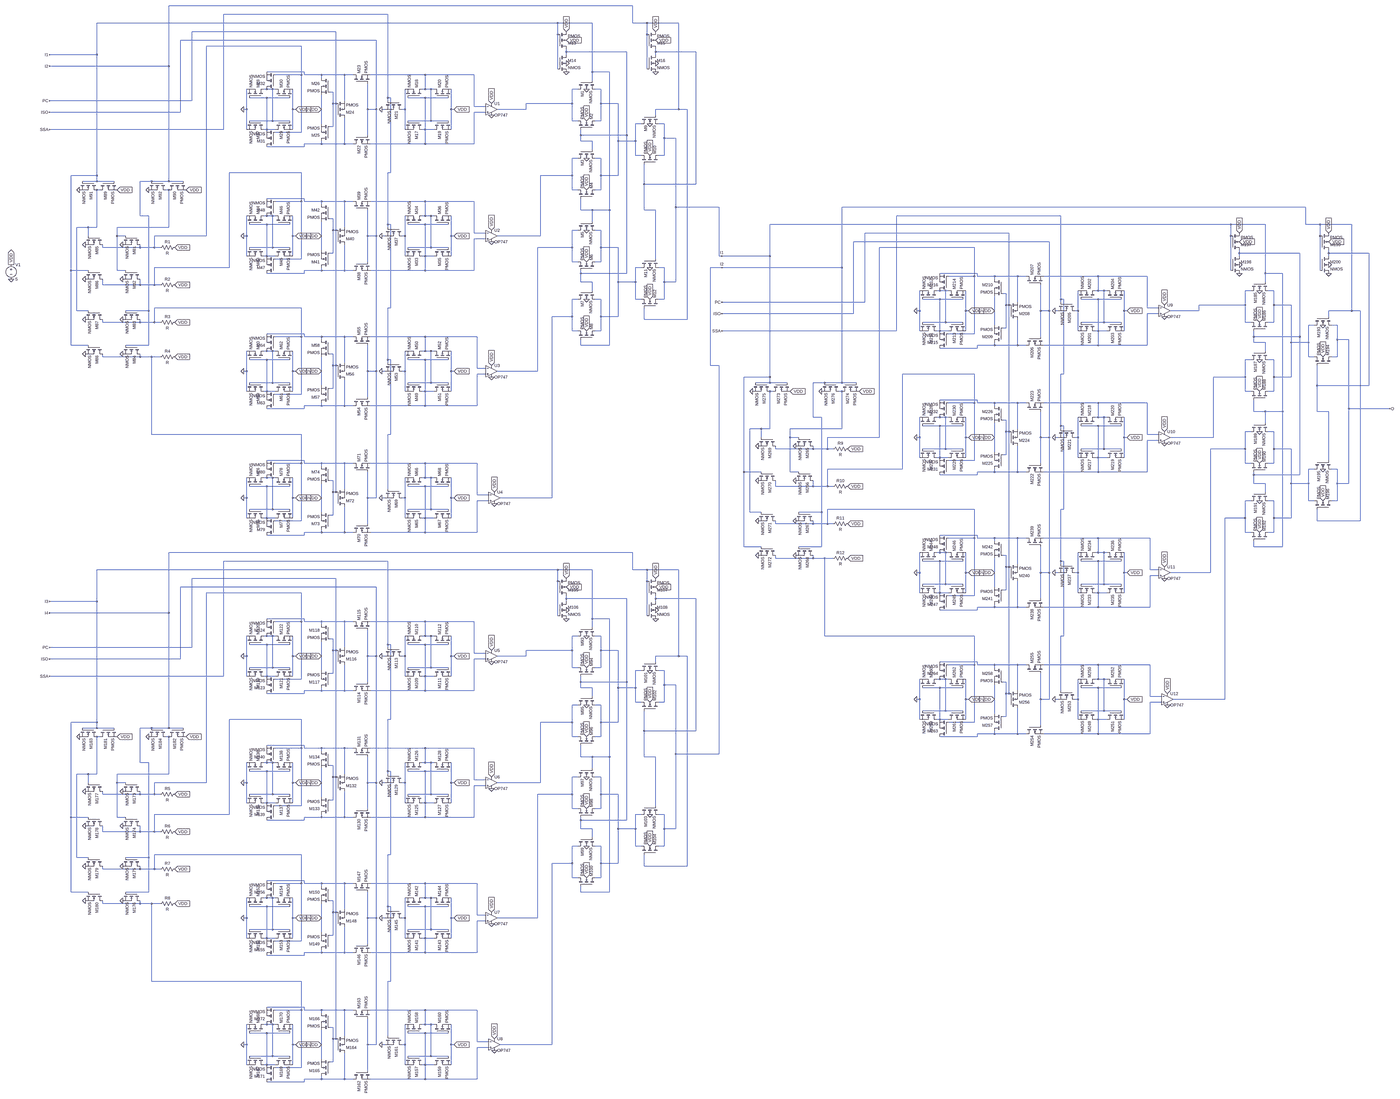
[diagram p0: schematic lut4using2.asc, whole sheet]
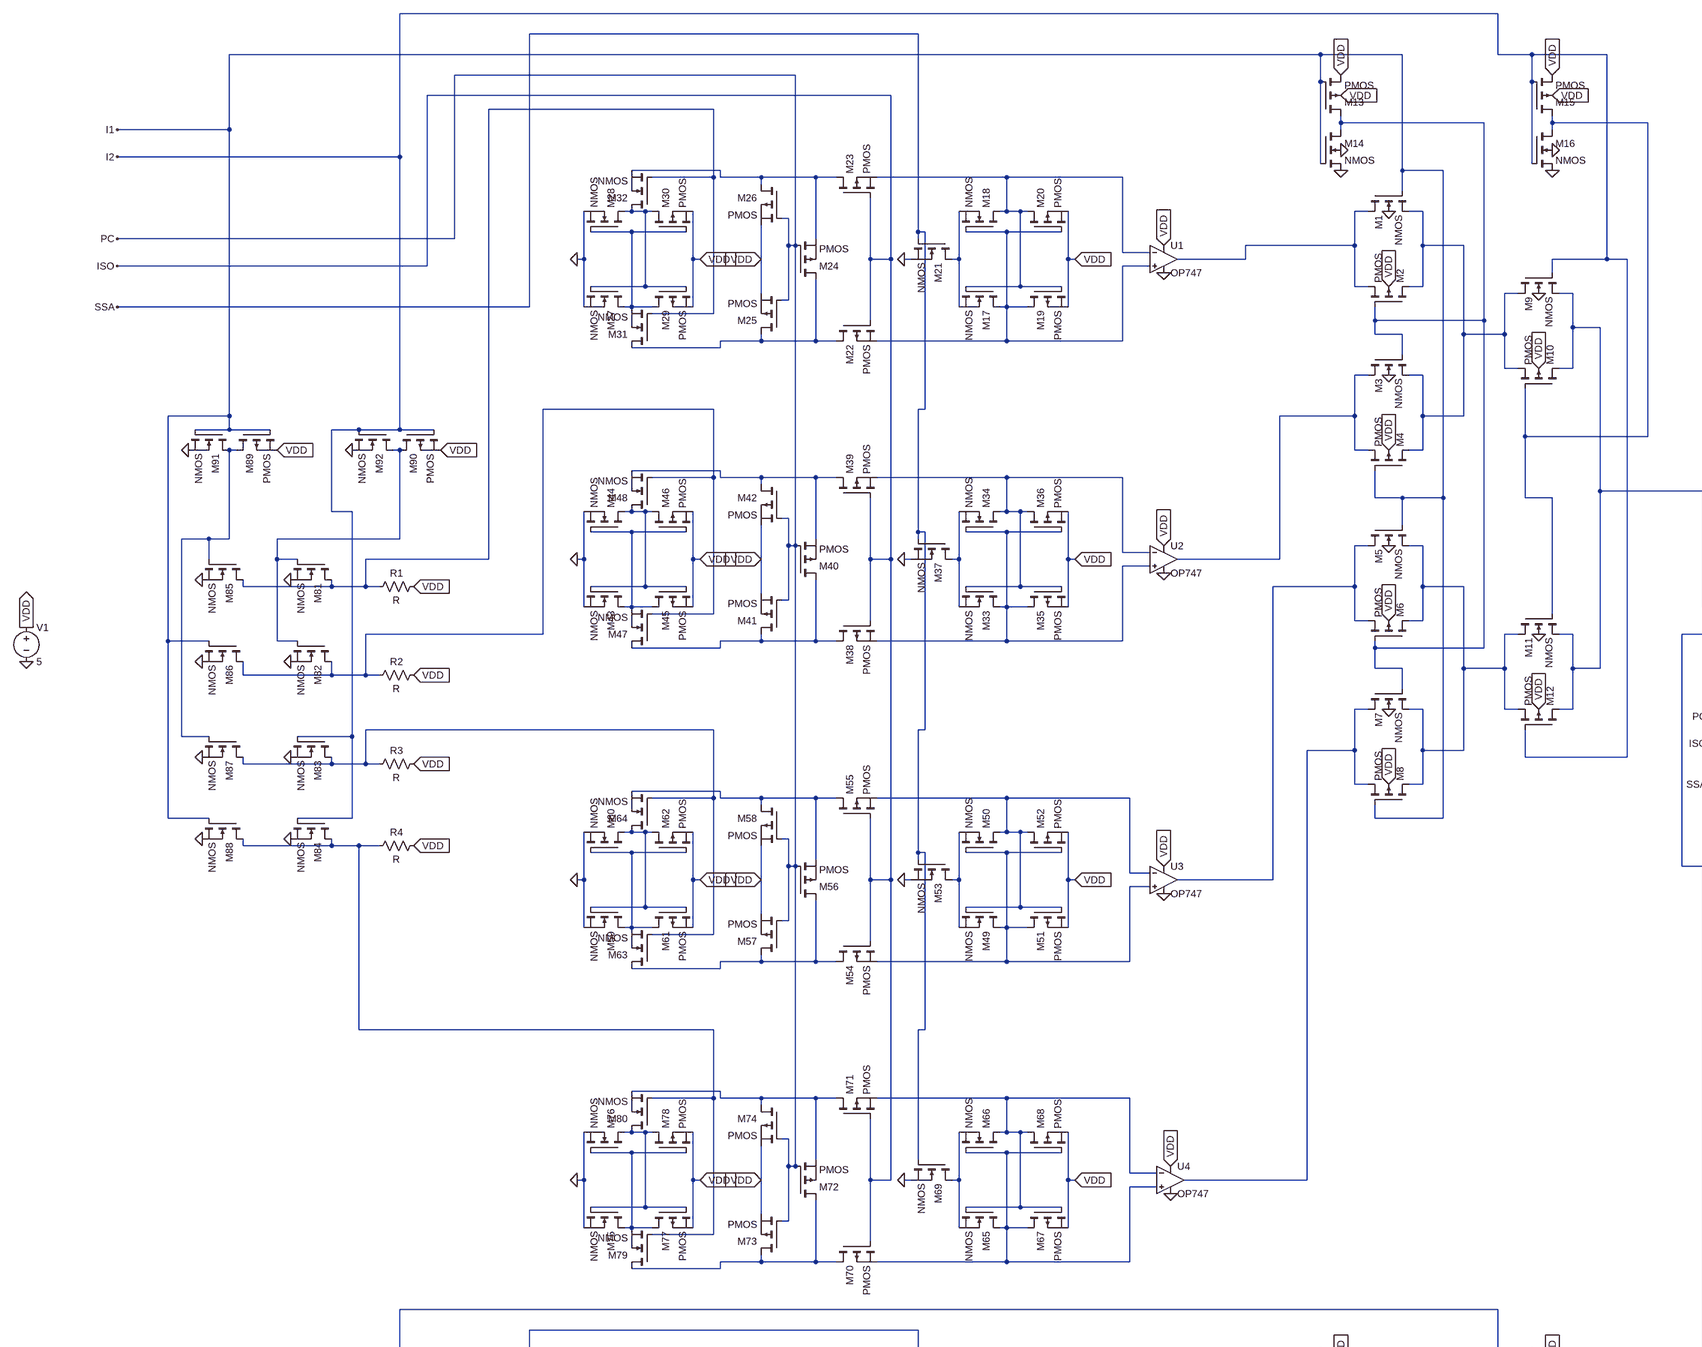
[diagram p1: schematic lut4using2.asc, part, row 1 of 2, column 1 of 2]
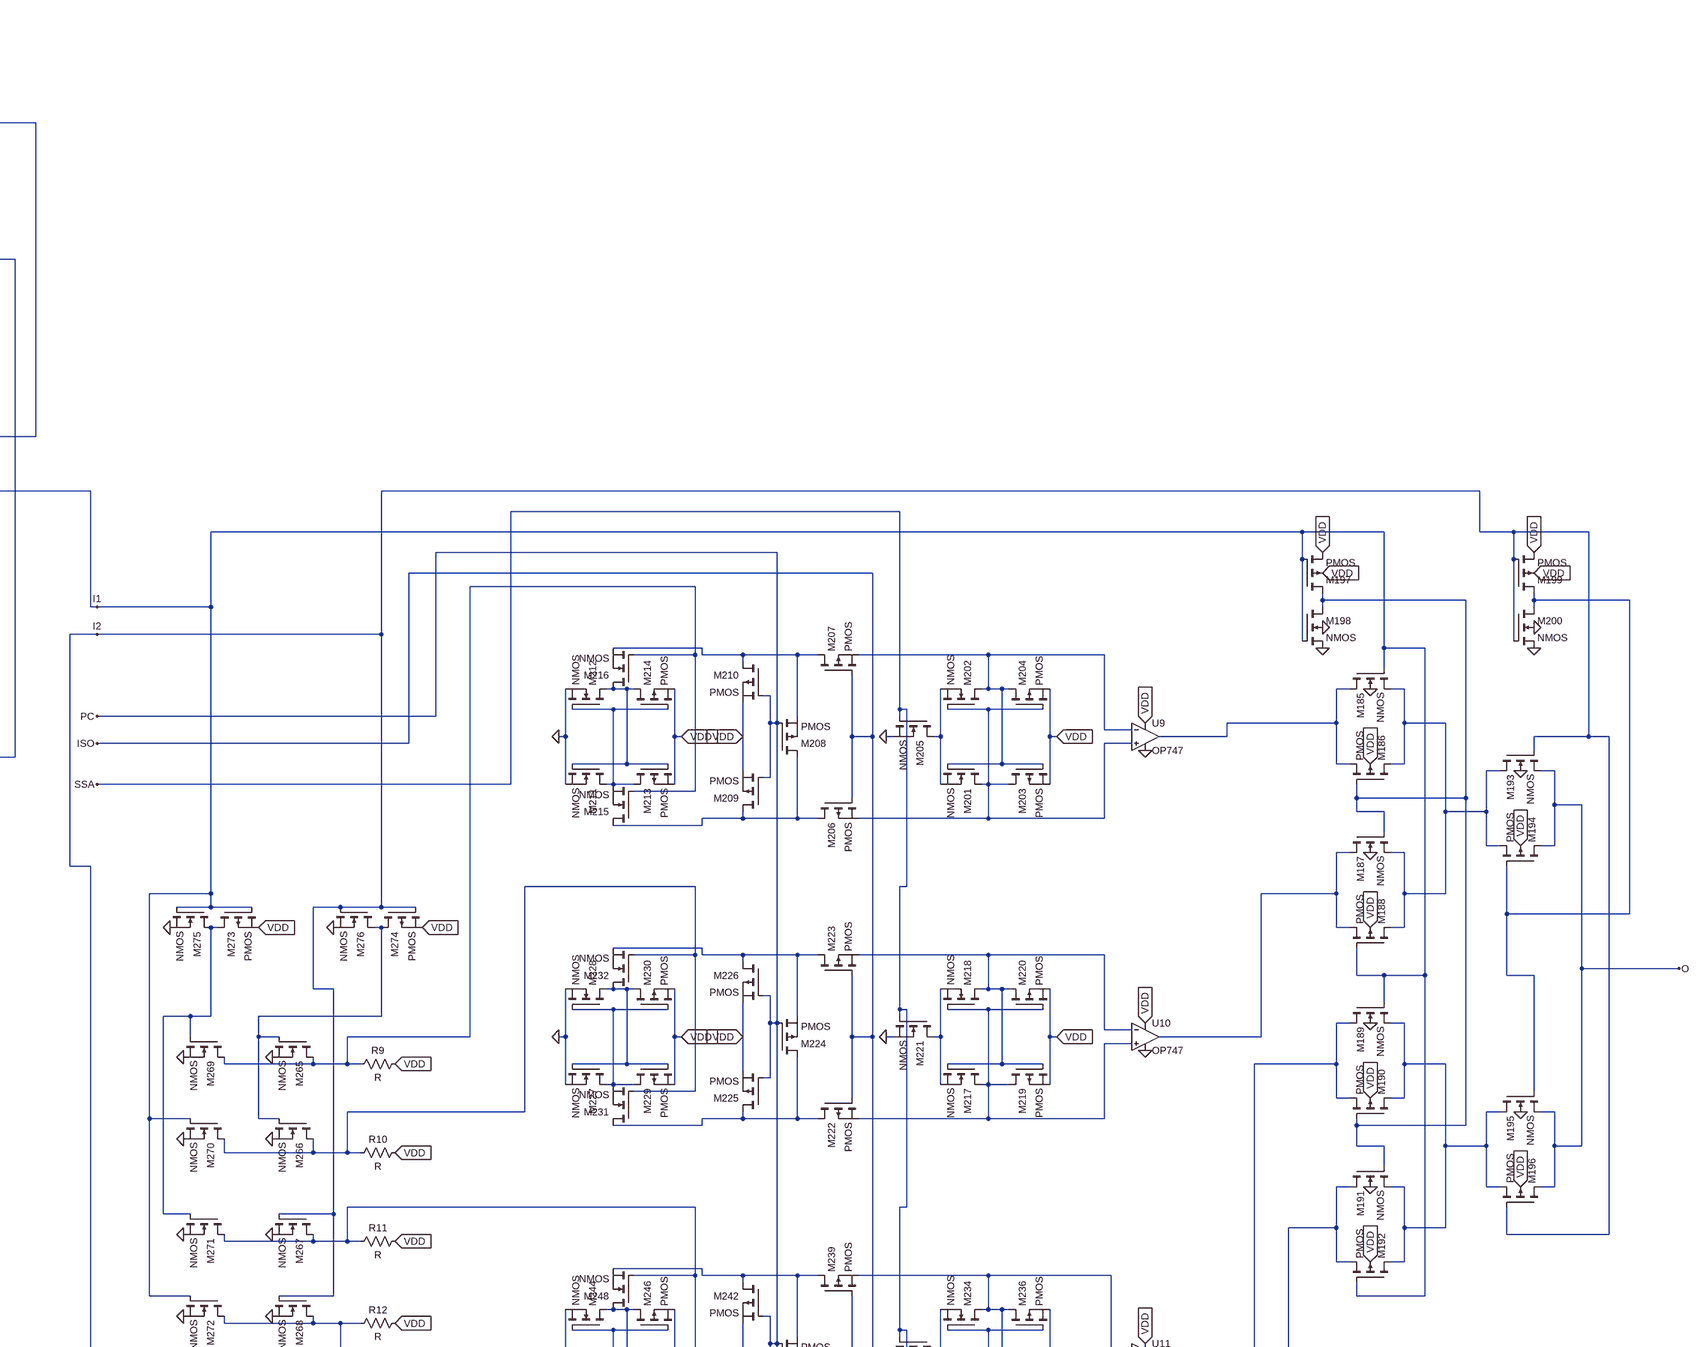
[diagram p2: schematic lut4using2.asc, part, row 1 of 2, column 2 of 2]
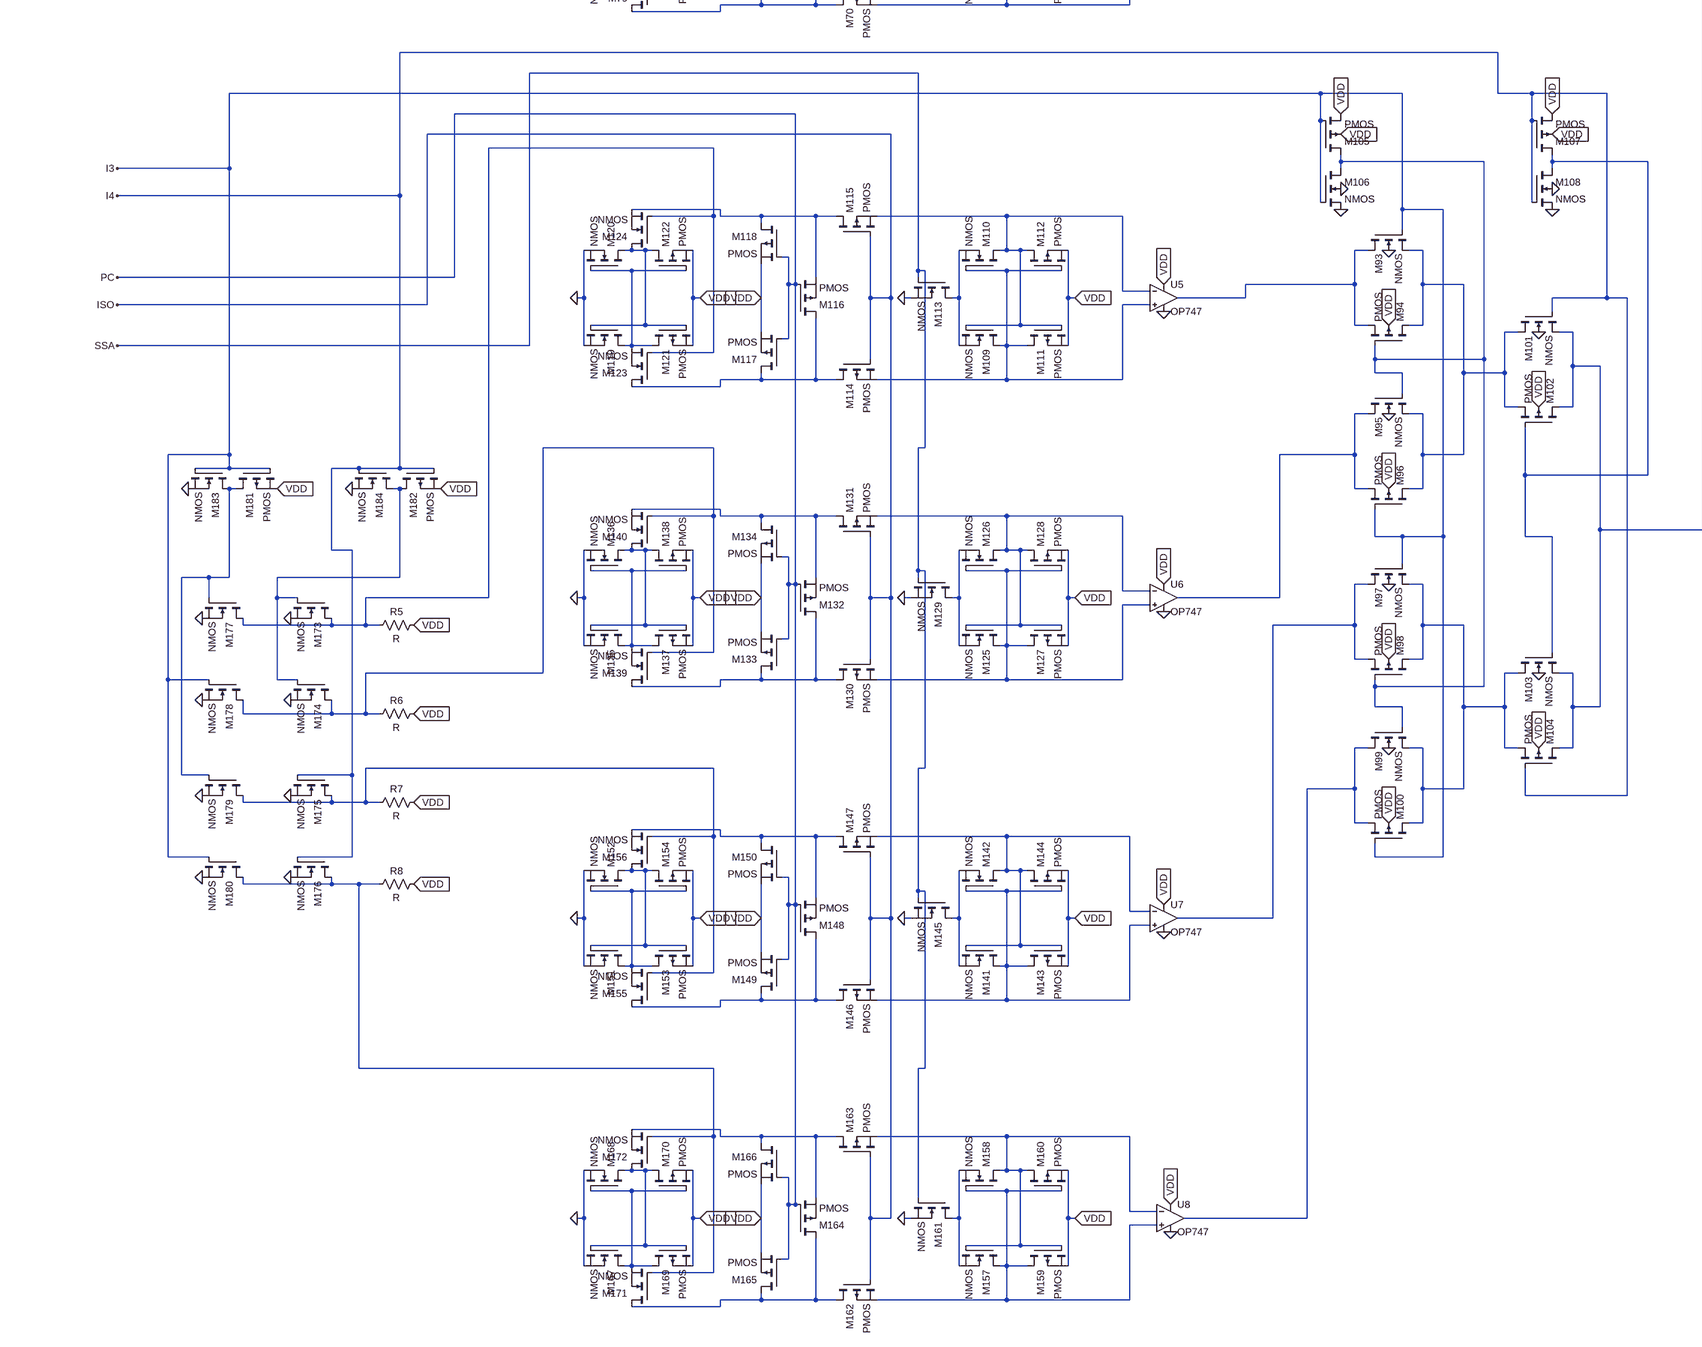
[diagram p3: schematic lut4using2.asc, part, row 2 of 2, column 1 of 2]
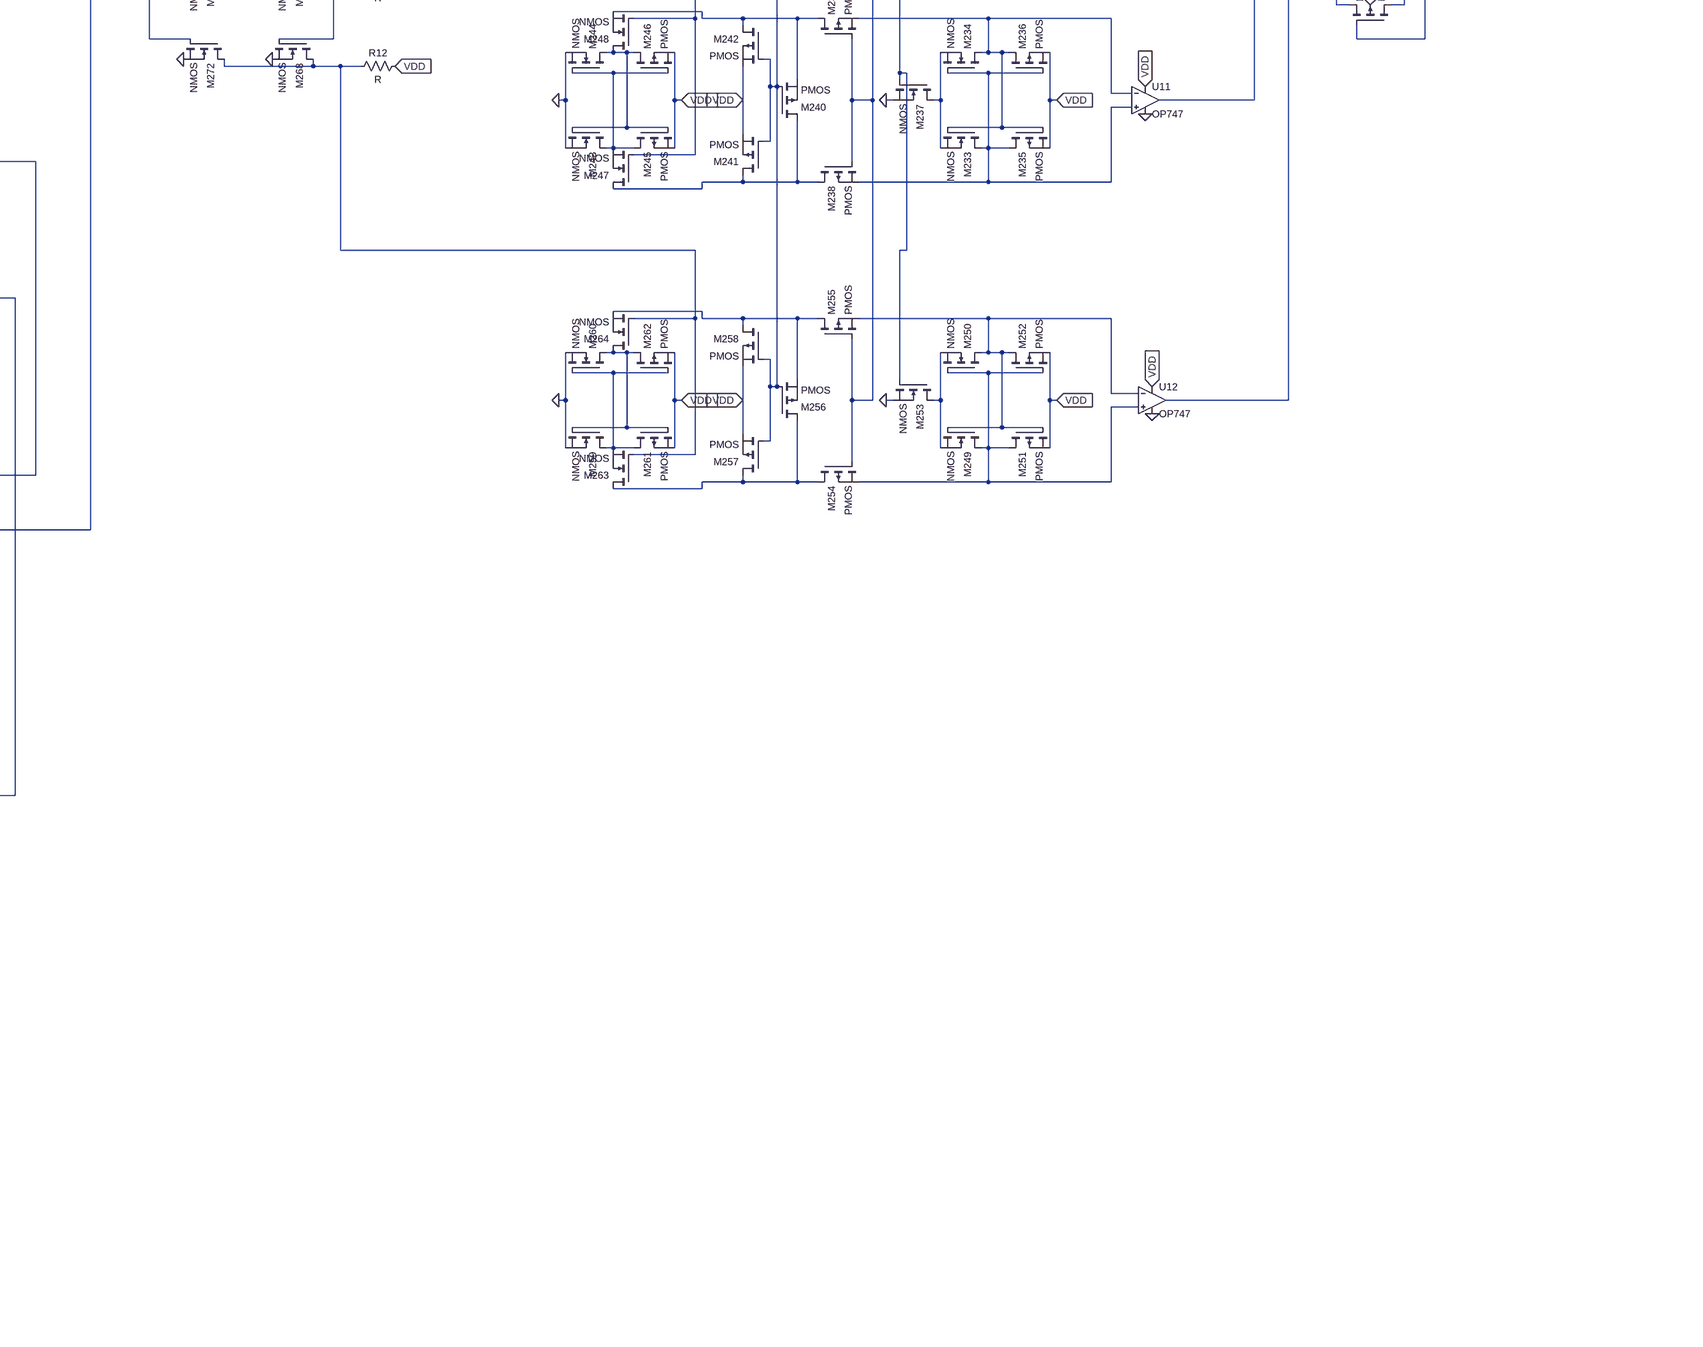
[diagram p4: schematic lut4using2.asc, part, row 2 of 2, column 2 of 2]
* lut4using2.asc
M1 N007 I1 N008 0 NMOS
M2 N008 N002 N007 VDD PMOS
M3 N013 N002 N008 0 NMOS
M4 N008 I1 N013 VDD PMOS
M5 N022 I1 N023 0 NMOS
M6 N023 N002 N022 VDD PMOS
M7 N034 N002 N023 0 NMOS
M8 N023 I1 N034 VDD PMOS
M9 N008 I2 I1 0 NMOS
M10 I1 N003 N008 VDD PMOS
M11 N023 N003 I1 0 NMOS
M12 I1 I2 N023 VDD PMOS
M13 N002 I1 VDD VDD PMOS
M14 N002 I1 0 0 NMOS
M15 N003 I2 VDD VDD PMOS
M16 N003 I2 0 0 NMOS
V1 VDD 0 5
M17 N010 N005 N011 N011 NMOS
M18 N005 N010 N011 N011 NMOS
M19 N010 N005 VDD VDD PMOS
M20 N005 N010 VDD VDD PMOS
M21 N011 SSA 0 0 NMOS
M22 N012 ISO N010 N010 PMOS
M23 N004 ISO N005 N005 PMOS
M24 N012 PC N004 N004 PMOS
M25 N012 PC VDD VDD PMOS
M26 N004 PC VDD VDD PMOS
M27 N009 N006 0 0 NMOS
M28 N006 N009 0 0 NMOS
M29 N009 N006 VDD VDD PMOS
M30 N006 N009 VDD VDD PMOS
M31 N012 N001 N009 N009 NMOS
M32 N006 N001 N004 N004 NMOS
M33 N021 N018 N024 N024 NMOS
M34 N018 N021 N024 N024 NMOS
M35 N021 N018 VDD VDD PMOS
M36 N018 N021 VDD VDD PMOS
M37 N024 SSA 0 0 NMOS
M38 N028 ISO N021 N021 PMOS
M39 N017 ISO N018 N018 PMOS
M40 N028 PC N017 N017 PMOS
M41 N028 PC VDD VDD PMOS
M42 N017 PC VDD VDD PMOS
M43 N020 N019 0 0 NMOS
M44 N019 N020 0 0 NMOS
M45 N020 N019 VDD VDD PMOS
M46 N019 N020 VDD VDD PMOS
M47 N028 N014 N020 N020 NMOS
M48 N019 N014 N017 N017 NMOS
M49 N045 N040 N047 N047 NMOS
M50 N040 N045 N047 N047 NMOS
M51 N045 N040 VDD VDD PMOS
M52 N040 N045 VDD VDD PMOS
M53 N047 SSA 0 0 NMOS
M54 N053 ISO N045 N045 PMOS
M55 N039 ISO N040 N040 PMOS
M56 N053 PC N039 N039 PMOS
M57 N053 PC VDD VDD PMOS
M58 N039 PC VDD VDD PMOS
M59 N044 N042 0 0 NMOS
M60 N042 N044 0 0 NMOS
M61 N044 N042 VDD VDD PMOS
M62 N042 N044 VDD VDD PMOS
M63 N053 N037 N044 N044 NMOS
M64 N042 N037 N039 N039 NMOS
M65 N065 N061 N066 N066 NMOS
M66 N061 N065 N066 N066 NMOS
M67 N065 N061 VDD VDD PMOS
M68 N061 N065 VDD VDD PMOS
M69 N066 SSA 0 0 NMOS
M70 N069 ISO N065 N065 PMOS
M71 N060 ISO N061 N061 PMOS
M72 N069 PC N060 N060 PMOS
M73 N069 PC VDD VDD PMOS
M74 N060 PC VDD VDD PMOS
M75 N064 N063 0 0 NMOS
M76 N063 N064 0 0 NMOS
M77 N064 N063 VDD VDD PMOS
M78 N063 N064 VDD VDD PMOS
M79 N069 N043 N064 N064 NMOS
M80 N063 N043 N060 N060 NMOS
XU1 N010 N005 VDD 0 N007 OP747  ; pins In+ In- V+ V- OUT
XU2 N021 N018 VDD 0 N013 OP747  ; pins In+ In- V+ V- OUT
XU3 N045 N040 VDD 0 N022 OP747  ; pins In+ In- V+ V- OUT
XU4 N065 N061 VDD 0 N034 OP747  ; pins In+ In- V+ V- OUT
M81 N001 N016 0 0 NMOS
M82 N014 N016 0 0 NMOS
R1 VDD N001 R
R2 VDD N014 R
R3 VDD N037 R
R4 VDD N043 R
M83 N037 I2 0 0 NMOS
M84 N043 I2 0 0 NMOS
M85 N001 N015 0 0 NMOS
M86 N014 I1 0 0 NMOS
M87 N037 N015 0 0 NMOS
M88 N043 I1 0 0 NMOS
M89 N015 I1 VDD VDD PMOS
M90 N016 I2 VDD VDD PMOS
M91 N015 I1 0 0 NMOS
M92 N016 I2 0 0 NMOS
M93 N084 I3 N085 0 NMOS
M94 N085 N078 N084 VDD PMOS
M95 N096 N078 N085 0 NMOS
M96 N085 I3 N096 VDD PMOS
M97 N106 I3 N107 0 NMOS
M98 N107 N078 N106 VDD PMOS
M99 N110 N078 N107 0 NMOS
M100 N107 I3 N110 VDD PMOS
M101 N085 I4 I2 0 NMOS
M102 I2 N079 N085 VDD PMOS
M103 N107 N079 I2 0 NMOS
M104 I2 I4 N107 VDD PMOS
M105 N078 I3 VDD VDD PMOS
M106 N078 I3 0 0 NMOS
M107 N079 I4 VDD VDD PMOS
M108 N079 I4 0 0 NMOS
M109 N087 N082 N088 N088 NMOS
M110 N082 N087 N088 N088 NMOS
M111 N087 N082 VDD VDD PMOS
M112 N082 N087 VDD VDD PMOS
M113 N088 SSA 0 0 NMOS
M114 N094 ISO N087 N087 PMOS
M115 N081 ISO N082 N082 PMOS
M116 N094 PC N081 N081 PMOS
M117 N094 PC VDD VDD PMOS
M118 N081 PC VDD VDD PMOS
M119 N086 N083 0 0 NMOS
M120 N083 N086 0 0 NMOS
M121 N086 N083 VDD VDD PMOS
M122 N083 N086 VDD VDD PMOS
M123 N094 N077 N086 N086 NMOS
M124 N083 N077 N081 N081 NMOS
M125 N105 N102 N108 N108 NMOS
M126 N102 N105 N108 N108 NMOS
M127 N105 N102 VDD VDD PMOS
M128 N102 N105 VDD VDD PMOS
M129 N108 SSA 0 0 NMOS
M130 N109 ISO N105 N105 PMOS
M131 N101 ISO N102 N102 PMOS
M132 N109 PC N101 N101 PMOS
M133 N109 PC VDD VDD PMOS
M134 N101 PC VDD VDD PMOS
M135 N104 N103 0 0 NMOS
M136 N103 N104 0 0 NMOS
M137 N104 N103 VDD VDD PMOS
M138 N103 N104 VDD VDD PMOS
M139 N109 N097 N104 N104 NMOS
M140 N103 N097 N101 N101 NMOS
M141 N117 N113 N118 N118 NMOS
M142 N113 N117 N118 N118 NMOS
M143 N117 N113 VDD VDD PMOS
M144 N113 N117 VDD VDD PMOS
M145 N118 SSA 0 0 NMOS
M146 N119 ISO N117 N117 PMOS
M147 N112 ISO N113 N113 PMOS
M148 N119 PC N112 N112 PMOS
M149 N119 PC VDD VDD PMOS
M150 N112 PC VDD VDD PMOS
M151 N116 N114 0 0 NMOS
M152 N114 N116 0 0 NMOS
M153 N116 N114 VDD VDD PMOS
M154 N114 N116 VDD VDD PMOS
M155 N119 N111 N116 N116 NMOS
M156 N114 N111 N112 N112 NMOS
M157 N124 N121 N125 N125 NMOS
M158 N121 N124 N125 N125 NMOS
M159 N124 N121 VDD VDD PMOS
M160 N121 N124 VDD VDD PMOS
M161 N125 SSA 0 0 NMOS
M162 N126 ISO N124 N124 PMOS
M163 N120 ISO N121 N121 PMOS
M164 N126 PC N120 N120 PMOS
M165 N126 PC VDD VDD PMOS
M166 N120 PC VDD VDD PMOS
M167 N123 N122 0 0 NMOS
M168 N122 N123 0 0 NMOS
M169 N123 N122 VDD VDD PMOS
M170 N122 N123 VDD VDD PMOS
M171 N126 N115 N123 N123 NMOS
M172 N122 N115 N120 N120 NMOS
XU5 N087 N082 VDD 0 N084 OP747  ; pins In+ In- V+ V- OUT
XU6 N105 N102 VDD 0 N096 OP747  ; pins In+ In- V+ V- OUT
XU7 N117 N113 VDD 0 N106 OP747  ; pins In+ In- V+ V- OUT
XU8 N124 N121 VDD 0 N110 OP747  ; pins In+ In- V+ V- OUT
M173 N077 N100 0 0 NMOS
M174 N097 N100 0 0 NMOS
R5 VDD N077 R
R6 VDD N097 R
R7 VDD N111 R
R8 VDD N115 R
M175 N111 I4 0 0 NMOS
M176 N115 I4 0 0 NMOS
M177 N077 N099 0 0 NMOS
M178 N097 I3 0 0 NMOS
M179 N111 N099 0 0 NMOS
M180 N115 I3 0 0 NMOS
M181 N099 I3 VDD VDD PMOS
M182 N100 I4 VDD VDD PMOS
M183 N099 I3 0 0 NMOS
M184 N100 I4 0 0 NMOS
M185 N032 I1 N033 0 NMOS
M186 N033 N026 N032 VDD PMOS
M187 N046 N026 N033 0 NMOS
M188 N033 I1 N046 VDD PMOS
M189 N057 I1 N058 0 NMOS
M190 N058 N026 N057 VDD PMOS
M191 N067 N026 N058 0 NMOS
M192 N058 I1 N067 VDD PMOS
M193 N033 I2 O 0 NMOS
M194 O N027 N033 VDD PMOS
M195 N058 N027 O 0 NMOS
M196 O I2 N058 VDD PMOS
M197 N026 I1 VDD VDD PMOS
M198 N026 I1 0 0 NMOS
M199 N027 I2 VDD VDD PMOS
M200 N027 I2 0 0 NMOS
M201 N036 N030 N038 N038 NMOS
M202 N030 N036 N038 N038 NMOS
M203 N036 N030 VDD VDD PMOS
M204 N030 N036 VDD VDD PMOS
M205 N038 SSA 0 0 NMOS
M206 N041 ISO N036 N036 PMOS
M207 N029 ISO N030 N030 PMOS
M208 N041 PC N029 N029 PMOS
M209 N041 PC VDD VDD PMOS
M210 N029 PC VDD VDD PMOS
M211 N035 N031 0 0 NMOS
M212 N031 N035 0 0 NMOS
M213 N035 N031 VDD VDD PMOS
M214 N031 N035 VDD VDD PMOS
M215 N041 N025 N035 N035 NMOS
M216 N031 N025 N029 N029 NMOS
M217 N056 N052 N059 N059 NMOS
M218 N052 N056 N059 N059 NMOS
M219 N056 N052 VDD VDD PMOS
M220 N052 N056 VDD VDD PMOS
M221 N059 SSA 0 0 NMOS
M222 N062 ISO N056 N056 PMOS
M223 N051 ISO N052 N052 PMOS
M224 N062 PC N051 N051 PMOS
M225 N062 PC VDD VDD PMOS
M226 N051 PC VDD VDD PMOS
M227 N055 N054 0 0 NMOS
M228 N054 N055 0 0 NMOS
M229 N055 N054 VDD VDD PMOS
M230 N054 N055 VDD VDD PMOS
M231 N062 N048 N055 N055 NMOS
M232 N054 N048 N051 N051 NMOS
M233 N075 N071 N076 N076 NMOS
M234 N071 N075 N076 N076 NMOS
M235 N075 N071 VDD VDD PMOS
M236 N071 N075 VDD VDD PMOS
M237 N076 SSA 0 0 NMOS
M238 N080 ISO N075 N075 PMOS
M239 N070 ISO N071 N071 PMOS
M240 N080 PC N070 N070 PMOS
M241 N080 PC VDD VDD PMOS
M242 N070 PC VDD VDD PMOS
M243 N074 N072 0 0 NMOS
M244 N072 N074 0 0 NMOS
M245 N074 N072 VDD VDD PMOS
M246 N072 N074 VDD VDD PMOS
M247 N080 N068 N074 N074 NMOS
M248 N072 N068 N070 N070 NMOS
M249 N093 N090 N095 N095 NMOS
M250 N090 N093 N095 N095 NMOS
M251 N093 N090 VDD VDD PMOS
M252 N090 N093 VDD VDD PMOS
M253 N095 SSA 0 0 NMOS
M254 N098 ISO N093 N093 PMOS
M255 N089 ISO N090 N090 PMOS
M256 N098 PC N089 N089 PMOS
M257 N098 PC VDD VDD PMOS
M258 N089 PC VDD VDD PMOS
M259 N092 N091 0 0 NMOS
M260 N091 N092 0 0 NMOS
M261 N092 N091 VDD VDD PMOS
M262 N091 N092 VDD VDD PMOS
M263 N098 N073 N092 N092 NMOS
M264 N091 N073 N089 N089 NMOS
XU9 N036 N030 VDD 0 N032 OP747  ; pins In+ In- V+ V- OUT
XU10 N056 N052 VDD 0 N046 OP747  ; pins In+ In- V+ V- OUT
XU11 N075 N071 VDD 0 N057 OP747  ; pins In+ In- V+ V- OUT
XU12 N093 N090 VDD 0 N067 OP747  ; pins In+ In- V+ V- OUT
M265 N025 N050 0 0 NMOS
M266 N048 N050 0 0 NMOS
R9 VDD N025 R
R10 VDD N048 R
R11 VDD N068 R
R12 VDD N073 R
M267 N068 I2 0 0 NMOS
M268 N073 I2 0 0 NMOS
M269 N025 N049 0 0 NMOS
M270 N048 I1 0 0 NMOS
M271 N068 N049 0 0 NMOS
M272 N073 I1 0 0 NMOS
M273 N049 I1 VDD VDD PMOS
M274 N050 I2 VDD VDD PMOS
M275 N049 I1 0 0 NMOS
M276 N050 I2 0 0 NMOS
.model NMOS NMOS
.model PMOS PMOS
.lib standard.mos
.backanno
.end